# Altium schematic sheet main.SchDoc
size A3
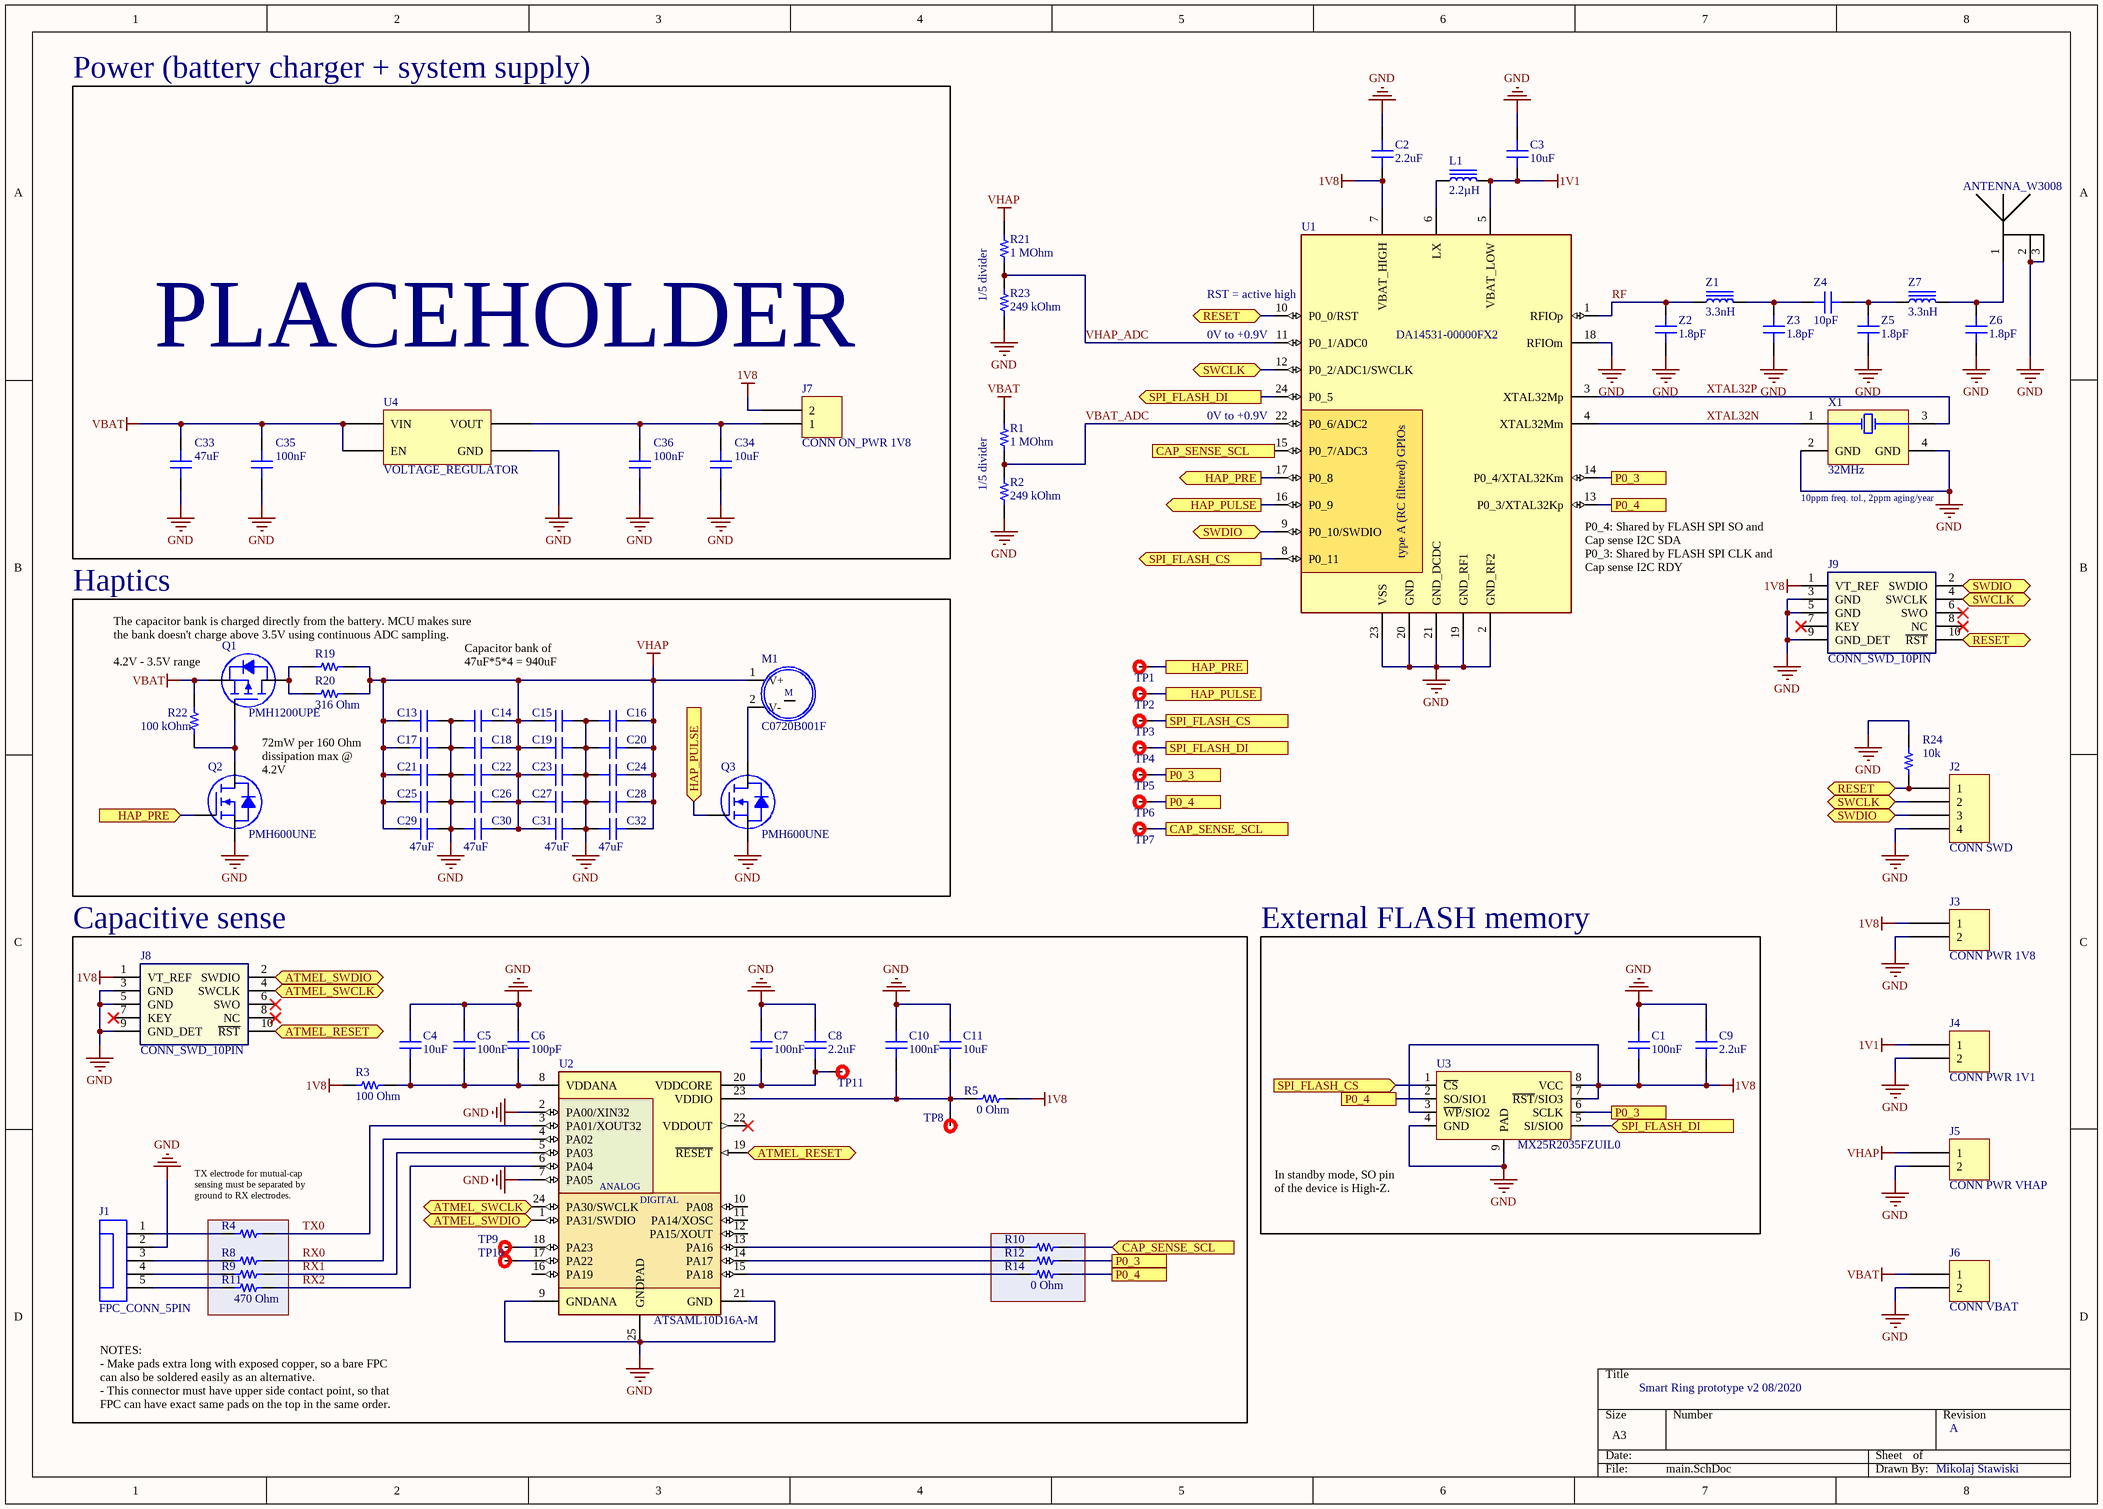
[diagram p0: main.SchDoc]

## Parts
C1  100nF  [SMD_CAPACITOR_0201]
C2  2.2uF  [SMD_CAPACITOR_0402]
C3  10uF  [SMD_CAPACITOR_0402]
C4  10uF  [SMD_CAPACITOR_0402]
C5  100nF  [SMD_CAPACITOR_0201]
C6  100pF  [SMD_CAPACITOR_0201]
C7  100nF  [SMD_CAPACITOR_0201]
C8  2.2uF  [SMD_CAPACITOR_0402]
C9  2.2uF  [SMD_CAPACITOR_0201]
C10  100nF  [SMD_CAPACITOR_0201]
C11  10uF  [SMD_CAPACITOR_0402]
C13  47uF  [SMD_CAPACITOR_0603]  (value not drawn)
C14  47uF  [SMD_CAPACITOR_0603]  (value not drawn)
C15  47uF  [SMD_CAPACITOR_0603]  (value not drawn)
C16  47uF  [SMD_CAPACITOR_0603]  (value not drawn)
C17  47uF  [SMD_CAPACITOR_0603]  (value not drawn)
C18  47uF  [SMD_CAPACITOR_0603]  (value not drawn)
C19  47uF  [SMD_CAPACITOR_0603]  (value not drawn)
C20  47uF  [SMD_CAPACITOR_0603]  (value not drawn)
C21  47uF  [SMD_CAPACITOR_0603]  (value not drawn)
C22  47uF  [SMD_CAPACITOR_0603]  (value not drawn)
C23  47uF  [SMD_CAPACITOR_0603]  (value not drawn)
C24  47uF  [SMD_CAPACITOR_0603]  (value not drawn)
C25  47uF  [SMD_CAPACITOR_0603]  (value not drawn)
C26  47uF  [SMD_CAPACITOR_0603]  (value not drawn)
C27  47uF  [SMD_CAPACITOR_0603]  (value not drawn)
C28  47uF  [SMD_CAPACITOR_0603]  (value not drawn)
C29  47uF  [SMD_CAPACITOR_0603]
C30  47uF  [SMD_CAPACITOR_0603]
C31  47uF  [SMD_CAPACITOR_0603]
C32  47uF  [SMD_CAPACITOR_0603]
C33  47uF  [SMD_CAPACITOR_0603]
C34  10uF  [SMD_CAPACITOR_0603]
C35  100nF  [SMD_CAPACITOR_0603]
C36  100nF  [SMD_CAPACITOR_0603]
J1  FPC_CONN_5PIN  [0545500571]
J2  CONN SWD  [MOLEX KK 0022272041]
J3  CONN PWR 1V8  [MOLEX KK 0022272021]
J4  CONN PWR 1V1  [MOLEX KK 0022272021]
J5  CONN PWR VHAP  [MOLEX KK 0022272021]
J6  CONN VBAT  [MOLEX KK 0022272021]
J7  CONN ON_PWR 1V8  [MOLEX KK 0022272021]
J8  CONN_SWD_10PIN  [CONN_SWD_10PIN]
J9  CONN_SWD_10PIN  [CONN_SWD_10PIN]
L1  2.2µH  [SMD_INDUCTOR_0603]
M1  C0720B001F  [C0720B001F]
Q1  PMH1200UPE  [DFN0606-3 (SOT8001)]
Q2  PMH600UNE  [DFN0606-3 (SOT8001)]
Q3  PMH600UNE  [DFN0606-3 (SOT8001)]
R1  1 MOhm  [SMD_RESISTOR_0201]
R2  249 kOhm  [SMD_RESISTOR_0201]
R3  100 Ohm  [SMD_RESISTOR_0201]
R4  470 Ohm  [SMD_RESISTOR_0201]  (value not drawn)
R5  0 Ohm  [SMD_RESISTOR_0201]
R8  470 Ohm  [SMD_RESISTOR_0201]  (value not drawn)
R9  470 Ohm  [SMD_RESISTOR_0201]  (value not drawn)
R10  0 Ohm  [SMD_RESISTOR_0201]  (value not drawn)
R11  470 Ohm  [SMD_RESISTOR_0201]
R12  0 Ohm  [SMD_RESISTOR_0201]  (value not drawn)
R14  0 Ohm  [SMD_RESISTOR_0201]
R19  316 Ohm  [SMD_RESISTOR_0201]  (value not drawn)
R20  316 Ohm  [SMD_RESISTOR_0201]
R21  1 MOhm  [SMD_RESISTOR_0201]
R22  100 kOhm  [SMD_RESISTOR_0201]
R23  249 kOhm  [SMD_RESISTOR_0201]
R24  10k  [SMD_RESISTOR_0603]
TP1  Testpoint  [Testpoint 1mm]  (value not drawn)
TP2  Testpoint  [Testpoint 1mm]  (value not drawn)
TP3  Testpoint  [Testpoint 1mm]  (value not drawn)
TP4  Testpoint  [Testpoint 1mm]  (value not drawn)
TP5  Testpoint  [Testpoint 1mm]  (value not drawn)
TP6  Testpoint  [Testpoint 1mm]  (value not drawn)
TP7  Testpoint  [Testpoint 1mm]  (value not drawn)
TP8  Testpoint  [Testpoint 1mm]  (value not drawn)
TP9  Testpoint  [Testpoint 1mm]  (value not drawn)
TP10  Testpoint  [Testpoint 1mm]  (value not drawn)
TP11  Testpoint  [Testpoint 1mm]  (value not drawn)
U1  DA14531-00000FX2  [DA14531-00000FX2-FCGQFN24]
U2  ATSAML10D16A-M  [VQFN24]
U3  MX25R2035FZUIL0  [USON-8L-2x3x0.6mm]
U4  VOLTAGE_REGULATOR  [SOT23-5]
X1  32MHz  [ABM12W]
Y  ANTENNA_W3008  [ANTENNA_W3008]
Z1  3.3nH  [SMD_INDUCTOR_0201]
Z2  1.8pF  [SMD_CAPACITOR_0201]
Z3  1.8pF  [SMD_CAPACITOR_0201]
Z4  10pF  [SMD_CAPACITOR_0201]
Z5  1.8pF  [SMD_CAPACITOR_0201]
Z6  1.8pF  [SMD_CAPACITOR_0201]
Z7  3.3nH  [SMD_INDUCTOR_0201]

## Blocks framed on the sheet
PLACEHOLDER: C33-C36 J7 U4
Haptics: C13-C32 M1 Q1-Q3 R19 R20 R22
Capacitive sense: C4-C8 C10 C11 J1 J8 R3-R5 R8-R12 R14 TP8-TP11 U2
External FLASH memory: C1 C9 U3

## Ports
ATMEL_RESET (bidir), ATMEL_SWCLK (bidir), ATMEL_SWDIO (bidir), CAP_SENSE_SCL, CAP_SENSE_SCL (in), CAP_SENSE_SCL (out), HAP_PRE, HAP_PRE (in), HAP_PRE (out), HAP_PULSE, HAP_PULSE (in), HAP_PULSE (out), P0_3, P0_4, RESET (bidir), SPI_FLASH_CS, SPI_FLASH_CS (in), SPI_FLASH_CS (out), SPI_FLASH_DI, SPI_FLASH_DI (in), SPI_FLASH_DI (out), SWCLK (bidir), SWDIO (bidir)

## Nets
1V1: C3.1 J4.1 L1.2 U1.5(VBAT_LOW)
1V8: C1.2 C2.1 C9.1 J3.1 J7.2 J8.1(VT_REF) J9.1(VT_REF) R3.1 R5.1 U1.7(VBAT_HIGH) U3.3(~{WP}/SIO2) U3.7(~{RST}/SIO3) U3.8(VCC)
GND: C1.1 C2.2 C3.2 C4.1 C5.1 C6.1 C7.1 C8.2 C9.2 C10.1 C11.1 C13.1 C14.2 C15.1 C16.2 C17.1 C18.2 C19.1 C20.2 C21.1 C22.2 C23.1 C24.2 C25.1 C26.2 C27.1 C28.2 C29.1 C30.2 C31.1 C32.2 C33.1 C34.1 C35.1 C36.1 J1.2 J2.4 J3.2 J4.2 J5.2 J6.2 J8.3(GND) J8.5(GND) J8.9(GND_DET) J9.3(GND) J9.5(GND) J9.9(GND_DET) Q2.S Q3.S R2.2 R23.2 R24.2 U1.2(GND_RF2) U1.18(RFIOm) U1.19(GND_RF1) U1.20(GND) U1.21(GND_DCDC) U1.23(VSS) U2.2(PA00/XIN32) U2.7(PA05) U2.9(GNDANA) U2.21(GND) U2.25(GNDPAD) U3.4(GND) U3.9(PAD) U4.2(GND) X1.2(GND) X1.4(GND) Y.2(GND) Y.3(GND) Z2.2 Z3.2 Z5.2 Z6.2
VBAT: C33.2 C35.2 J6.1 Q1.S R1.1 R22.1 U4.1(VIN) U4.3(EN)
VHAP: C13.2 C14.1 C15.2 C16.1 C17.2 C18.1 C19.2 C20.1 C21.2 C22.1 C23.2 C24.1 C25.2 C26.1 C27.2 C28.1 C29.2 C30.1 C31.2 C32.1 J5.1 M1.1(V+) R19.2 R20.2 R21.1
ATMEL_RESET: J8.10(~{RST}) U2.19(~{RESET}) ; port ATMEL_RESET
ATMEL_SWCLK: J8.4(SWCLK) U2.24(PA30/SWCLK) ; port ATMEL_SWCLK
ATMEL_SWDIO: J8.2(SWDIO) U2.1(PA31/SWDIO) ; port ATMEL_SWDIO
CAP_SENSE_SCL: R10.1 TP7.1 U1.15(P0_7/ADC3) ; port CAP_SENSE_SCL
HAP_PRE: Q2.G TP1.1 U1.17(P0_8) ; port HAP_PRE
HAP_PULSE: Q3.G TP2.1 U1.16(P0_9) ; port HAP_PULSE
P0_3: R12.1 TP5.1 U1.14(P0_4/XTAL32Km) U3.6(SCLK) ; port P0_3
P0_4: R14.1 TP6.1 U1.13(P0_3/XTAL32Kp) U3.2(SO/SIO1) ; port P0_4
RESET: J2.1 J9.10(~{RST}) R24.1 U1.10(P0_0/RST) ; port RESET
RF: U1.1(RFIOp) Z1.1 Z2.1
RX0: R8.1 U2.4(PA02)
RX1: R9.1 U2.5(PA03)
RX2: R11.1 U2.6(PA04)
SPI_FLASH_CS: TP3.1 U1.8(P0_11) U3.1(~{CS}) ; port SPI_FLASH_CS
SPI_FLASH_DI: TP4.1 U1.24(P0_5) U3.5(SI/SIO0) ; port SPI_FLASH_DI
SWCLK: J2.2 J9.4(SWCLK) U1.12(P0_2/ADC1/SWCLK) ; port SWCLK
SWDIO: J2.3 J9.2(SWDIO) U1.9(P0_10/SWDIO) ; port SWDIO
TX0: R4.1 U2.3(PA01/XOUT32)
VBAT_ADC: R1.2 R2.1 U1.22(P0_6/ADC2)
VHAP_ADC: R21.2 R23.1 U1.11(P0_1/ADC0)
XTAL32N: U1.4(XTAL32Mm) X1.1(X1)
XTAL32P: U1.3(XTAL32Mp) X1.3(X2)
NetC4_2: C4.2 C5.2 C6.2 R3.2 U2.8(VDDANA)
NetC7_2: C7.2 C8.1 TP11.1 U2.20(VDDCORE)
NetC10_2: C10.2 C11.2 R5.2 TP8.1 U2.23(VDDIO)
NetC34_2: C34.2 C36.2 J7.1 U4.5(VOUT)
NetJ1_1: J1.1 R4.2
NetJ1_3: J1.3 R8.2
NetJ1_4: J1.4 R9.2
NetJ1_5: J1.5 R11.2
NetL1_1: L1.1 U1.6(LX)
NetM1_2: M1.2(V-) Q3.D
NetQ1_D: Q1.D R19.1 R20.1
NetQ1_G: Q1.G Q2.D R22.2
NetR10_2: R10.2 U2.13(PA16)
NetR12_2: R12.2 U2.14(PA17)
NetR14_2: R14.2 U2.15(PA18)
NetTP9_1: TP9.1 U2.18(PA23)
NetTP10_1: TP10.1 U2.17(PA22)
NetY_1: Y.1(RF) Z6.1 Z7.2
NetZ1_2: Z1.2 Z3.1 Z4.1
NetZ4_2: Z4.2 Z5.1 Z7.1

Not connected (* = marked no-connect by the designer): J8 6(SWO)* 7(KEY)* 8(NC)*; J9 6(SWO)* 7(KEY)* 8(NC)*; U2 10(PA08) 11(PA14/XOSC) 12(PA15/XOUT) 16(PA19) 22(VDDOUT)*

## Notes on the sheet
- Power (battery charger + system supply)
- 1/5 divider
- (near U1) RST = active high
- (near U1) 0V to +0.9V
- (near X1) 10ppm freq. tol., 2ppm aging/year
- (near U1) P0_4: Shared by FLASH SPI SO and Cap sense I2C SDA
  P0_3: Shared by FLASH SPI CLK and Cap sense I2C RDY
- The capacitor bank is charged directly from the battery. MCU makes sure the bank doesn't charge above 3.5V using continuous ADC sampling.
- 4.2V - 3.5V range
- Capacitor bank of
  47uF*5*4 = 940uF
- 72mW per 160 Ohm dissipation max @ 4.2V
- (near R4) TX electrode for mutual-cap sensing must be separated by ground to RX electrodes.
- (near U3) In standby mode, SO pin of the device is High-Z.
- Smart Ring prototype v2 08/2020
- NOTES:
  - Make pads extra long with exposed copper, so a bare FPC can also be soldered easily as an alternative.
  - This connector must have upper side contact point, so that FPC can have exact same pads on the top in the same order.
- A
- Mikolaj Stawiski
- (in symbol ATSAML10D16A-M) ANALOG; DIGITAL
- (in symbol C0720B001F) M
- (in symbol DA14531-00000FX2) type A (RC filtered) GPIOs

## Library data of the parts
C1 C5 C7 C10 = GRM033R61A104KE84D: Ceramic capacitor 100nF 10% 6.3V X5R 0201; Value: 100nF; Device Package: 0201 (0603 Metric); Mounting Type: Surface Mount, MLCC; Package / Case: 0201 (0603 Metric); Size / Dimension: 0.024" L x 0.012" W (0.60mm x 0.30mm)
C2 C8 = C0402C475M9PAC7867: Ceramic Capacitor 2.2uF 20% 6.3V X5R 0402; Value: 2.2uF; Device Package: 0402 (1005 Metric); Mounting Type: Surface Mount, MLCC; Package / Case: 0402 (1005 Metric); Size / Dimension: 0.039" L x 0.020" W (1.00mm x 0.50mm)
C3 C4 C11 = C0402C475M9PAC7867: Ceramic Capacitor 10uF 20% 6.3V X5R 0402; Value: 10uF; Device Package: 0402 (1005 Metric); Mounting Type: Surface Mount, MLCC; Package / Case: 0402 (1005 Metric); Size / Dimension: 0.039" L x 0.020" W (1.00mm x 0.50mm)
C6 = GRM033R61A104KE84D: Ceramic capacitor 100pF 10% 16V X7R 0201; Value: 100pF; Device Package: 0201 (0603 Metric); Mounting Type: Surface Mount, MLCC; Package / Case: 0201 (0603 Metric); Size / Dimension: 0.024" L x 0.012" W (0.60mm x 0.30mm)
C9 = C0402C475M9PAC7867: Ceramic Capacitor 2.2uF 20% 6.3V X5R 0201; Value: 2.2uF; Device Package: 0201 (0603 Metric); Mounting Type: Surface Mount, MLCC; Package / Case: 0201 (0603 Metric); Size / Dimension: 0.024" L x 0.012" W (0.60mm x 0.30mm)
C13-C32 = C0402C475M9PAC7867: Ceramic capacitor 4.7uF 20% 6.3V X5R 0402; Part Number: GRM188R60G476ME15D; Manufacturer: Murata; Voltage - Rated: 4V; Value: 47uF; Device Package: 0603 (1608 Metric); Mounting Type: Surface Mount, MLCC; Operating Temperature: -55°C ~ 85°C; Package / Case: 0603 (1608 Metric); Size / Dimension: 0.063" L x 0.031" W (1.60mm x 0.80mm); Temperature Coefficient: X5R; Thickness (Max): 1mm; Tolerance: ±20%
C33 = C0402C475M9PAC7867: Ceramic capacitor 47uF 20% 6.3V X5R 0603; Part Number: GRM188R60G476ME15D; Manufacturer: Murata; Voltage - Rated: 4V; Value: 47uF; Device Package: 0603 (1608 Metric); Mounting Type: Surface Mount, MLCC; Operating Temperature: -55°C ~ 85°C; Package / Case: 0603 (1608 Metric); Size / Dimension: 0.063" L x 0.031" W (1.60mm x 0.80mm); Temperature Coefficient: X5R; Thickness (Max): 1mm; Tolerance: ±20%
C34 = C0402C475M9PAC7867: Ceramic capacitor 10uF 20% 6.3V X5R 0603; Part Number: GRM188R60G476ME15D; Manufacturer: Murata; Voltage - Rated: 4V; Value: 10uF; Device Package: 0603 (1608 Metric); Mounting Type: Surface Mount, MLCC; Operating Temperature: -55°C ~ 85°C; Package / Case: 0603 (1608 Metric); Size / Dimension: 0.063" L x 0.031" W (1.60mm x 0.80mm); Temperature Coefficient: X5R; Thickness (Max): 1mm; Tolerance: ±20%
C35 C36 = C0402C475M9PAC7867: Ceramic capacitor 100nF 20% 6.3V X5R 0603; Part Number: GRM188R60G476ME15D; Manufacturer: Murata; Voltage - Rated: 4V; Value: 100nF; Device Package: 0603 (1608 Metric); Mounting Type: Surface Mount, MLCC; Operating Temperature: -55°C ~ 85°C; Package / Case: 0603 (1608 Metric); Size / Dimension: 0.063" L x 0.031" W (1.60mm x 0.80mm); Temperature Coefficient: X5R; Thickness (Max): 1mm; Tolerance: ±20%
J1 = FPC_CONN_5PIN: Manufacturer: Molex
J2 = 0022272041: CONN HEADER VERT 4POS 2.54MM; Manufacturer: Molex; Contact Length - Mating: 0.295" (7.49mm); Contact Length - Post: 0.140" (3.56mm); Material Flammability Rating: UL94 V-0; Number of Positions: 4; Number of Positions Loaded: All; Overall Contact Length: 0.560" (14.22mm); Pitch - Mating: 0.100" (2.54mm); Shrouding: Shrouded - 1 Wall; Style: Board to Cable/Wire; Part Number: 0022272041; ComponentLink1Description: Datasheet; ComponentLink1URL: https://www.molex.com/pdm_docs/sd/022272041_sd.pdf; ComponentLink2Description: DigiKey Link; ComponentLink2URL: http://digikey.com/product-detail/en/molex/0022272041/WM4113-ND/1130579; Connector Type: Header; Contact Finish - Mating: Tin; Contact Finish - Post: Tin; Contact Finish Thickness - Mating: 100.0µin (2.54µm); Contact Material: Brass; Contact Shape: Square; Contact Type: Male Pin; Fastening Type: Friction Lock; Insulation Color: Natural; Insulation Height: 0.461" (11.70mm); Insulation Material: Polyamide (PA), Nylon; LastUpdated: 2020-01-12 11:52:05 PM; Lifecycle Status: Active; Minimum Order: 1; Mounting Type: Through Hole; Number of Rows: 1; Packaging: Bulk; PartId: 78; Part Status: Active; Price: 0.40; Series: KK 6410; Supplier 1: DigiKey; Supplier Part Number 1: WM4113-ND; Termination: Solder
J3-J7 = 0022272021: CONN HEADER VERT 2POS 2.54MM; Manufacturer: Molex; Contact Length - Mating: 0.295" (7.49mm); Contact Length - Post: 0.140" (3.56mm); Material Flammability Rating: UL94 V-0; Number of Positions: 2; Number of Positions Loaded: All; Overall Contact Length: 0.560" (14.22mm); Pitch - Mating: 0.100" (2.54mm); Shrouding: Shrouded - 1 Wall; Style: Board to Cable/Wire; Part Number: 0022272021; ComponentLink1Description: Datasheet; ComponentLink1URL: https://www.molex.com/pdm_docs/sd/022272021_sd.pdf; ComponentLink2Description: DigiKey Link; ComponentLink2URL: http://digikey.com/product-detail/en/molex/0022272021/WM4111-ND/1130577; Connector Type: Header; Contact Finish - Mating: Tin; Contact Finish - Post: Tin; Contact Finish Thickness - Mating: 100.0µin (2.54µm); Contact Material: Brass; Contact Shape: Square; Contact Type: Male Pin; Fastening Type: Friction Lock; Insulation Color: Natural; Insulation Height: 0.461" (11.70mm); Insulation Material: Polyamide (PA), Nylon; LastUpdated: 2020-01-12 11:51:43 PM; Lifecycle Status: Active; Minimum Order: 1; Mounting Type: Through Hole; Number of Rows: 1; Packaging: Bulk; PartId: 76; Part Status: Active; Price: 0.27; Series: KK 6410; Supplier 1: DigiKey; Supplier Part Number 1: WM4111-ND; Termination: Solder
J8 J9 = CONN_SWD_10PIN: 10-pin ARM SWD connector for debugging; Manufacturer: Samtec; Part Number: FTSH-105-01-L-DV-K
L1 = MLZ1005M2R2WT000: FIXED IND 2.2UH 350MA 550 MOHM; Part Number: MLZ1608N2R2LT000; Manufacturer: TDK Corporation; Shielding: Shielded; Tolerance: ±20%; Device Package: 0603; Height - Seated (Max): 0.95mm; Inductance: 2.2µH; Operating Temperature: -55°C ~ 125°C; Package / Case: 0402 (1005 Metric); Value: 2.2µH
M1 = C0720B001F: DC Motor Vibration, ERM 10000 RPM 3VDC; MF: Jinlong Machinery; Digi-Key_Part_Number: 1670-1000-ND; Package: Jinlong Machinery; MP: C0720B001F; Value: *
Q1 = P_MOS_GDS: Manufacturer: Nexperia; Part Number: PMH1200UPE; Package / Case: 3-XFDFN; Operating Temperature: *
Q2 Q3 = N_MOS_GDS: Manufacturer: Nexperia; Part Number: PMH600UNE; Package / Case: 3-XFDFN; Operating Temperature: *
R1 R21 = CRCW0201100RFKED: RES SMD 1 MOhm 1% 1/20W 0201; Power (Watts): 0.05W, 1/20W; Value: 1 MOhm; Composition: Thick Film; Device Package: 0201 (0603 Metric); Package / Case: 0201 (0603 Metric); Size / Dimension: 0.024" L x 0.012" W (0.60mm x 0.30mm)
R2 R23 = CRCW0201100RFKED: RES SMD 249 kOhm 1% 1/20W 0201; Power (Watts): 0.05W, 1/20W; Value: 249 kOhm; Composition: Thick Film; Device Package: 0201 (0603 Metric); Package / Case: 0201 (0603 Metric); Size / Dimension: 0.024" L x 0.012" W (0.60mm x 0.30mm)
R3 = CRCW0201100RFKED: RES SMD 100 Ohm 5% 1/20W 0201; Power (Watts): 0.05W, 1/20W; Value: 100 Ohm; Composition: Thick Film; Device Package: 0201 (0603 Metric); Package / Case: 0201 (0603 Metric); Size / Dimension: 0.024" L x 0.012" W (0.60mm x 0.30mm)
R4 R8 R9 R11 = CRCW0201100RFKED: RES SMD 470 Ohm 5% 1/20W 0201; Power (Watts): 0.05W, 1/20W; Value: 470 Ohm; Composition: Thick Film; Device Package: 0201 (0603 Metric); Package / Case: 0201 (0603 Metric); Size / Dimension: 0.024" L x 0.012" W (0.60mm x 0.30mm)
R5 R10 R12 R14 = CRCW0201100RFKED: RES SMD 0 Ohm 1/20W 0201; Power (Watts): 0.05W, 1/20W; Value: 0 Ohm; Composition: Thick Film; Device Package: 0201 (0603 Metric); Package / Case: 0201 (0603 Metric); Size / Dimension: 0.024" L x 0.012" W (0.60mm x 0.30mm)
R19 R20 = CRCW0201100RFKED: RES SMD 316 Ohm 5% 1/20W 0201; Power (Watts): 0.05W, 1/20W; Value: 316 Ohm; Composition: Thick Film; Device Package: 0201 (0603 Metric); Package / Case: 0201 (0603 Metric); Size / Dimension: 0.024" L x 0.012" W (0.60mm x 0.30mm)
R22 = CRCW0201100RFKED: RES SMD 100 kOhm 1% 1/20W 0201; Power (Watts): 0.05W, 1/20W; Value: 100 kOhm; Composition: Thick Film; Device Package: 0201 (0603 Metric); Package / Case: 0201 (0603 Metric); Size / Dimension: 0.024" L x 0.012" W (0.60mm x 0.30mm)
R24 = CRCW0201100RFKED: RES SMD 10k 5% 1/8W 0603; Power (Watts): 0.05W, 1/20W; Value: 10k; Composition: Thick Film; Device Package: 0201 (0603 Metric); Package / Case: 0603; Size / Dimension: 0.024" L x 0.012" W (0.60mm x 0.30mm)
TP1-TP11 = Testpoint: Testpoint for measuring at the PCB
U1 = DA14531-00000FX2: IC RF TxRx + MCU Bluetooth Bluetooth v5.1 2.4GHz 24-WFQFN, FC; Manufacturer: Dialog Semiconductor GmbH; Package: WFQFN-24 Dialog Semiconductor GmbH
U2 = ATSAML10D16A-M: ARM® Cortex®-M23 SAM L10 Microcontroller IC 32-Bit 32MHz 64KB FLASH 24-VQFN (4x4); Manufacturer: Microchip (Atmel); Part Number: ATSAML10D16A-M*; Package / Case: VQFN-24
U3 = MX25R2035FZUIL0: Manufacturer: Macronix
X1 = CRYSTAL_4PIN_SMD
Z1 Z7 = LQW15AN3N3D8ZD: RF Inductor 3.3nH ±0.1nH 450mA 250mOhm; Part Number: LQP03TN3N3B02D; Manufacturer: Murata Electronics; Device Package: 0201; Height - Seated (Max): 0.33mm; Operating Temperature: -55°C ~ 125°C; Package / Case: 0201; Size / Dimension: 0.60mm x 0.30mm; Tolerance: ±0.1nH; Value: 3.3nH
Z2-Z6 = GRM033R61A104KE84D: Ceramic capacitor 1.8pF ±0.25pF 50V C0G (NP0) 0201; Device Package: 0201 (0603 Metric); Mounting Type: Surface Mount, MLCC; Package / Case: 0201 (0603 Metric); Size / Dimension: 0.024" L x 0.012" W (0.60mm x 0.30mm)
  Z2 Z3 Z5 Z6: Value: 1.8pF
  Z4: Value: 10pF